# Altium schematic sheet BUTTONS.SchDoc: =DocumentName
size A4; CompanyName: "AS Manufacturing" LLC; Organization: "AS Manufacturing" LLC; Address1: 5 Sklyarenka St.; Address2: Kyiv 04073; Address3: Ukraine; Address4: https://ajax.systems/en/; SheetNumber: 5; SheetTotal: 5; Template_version: 1.0.1
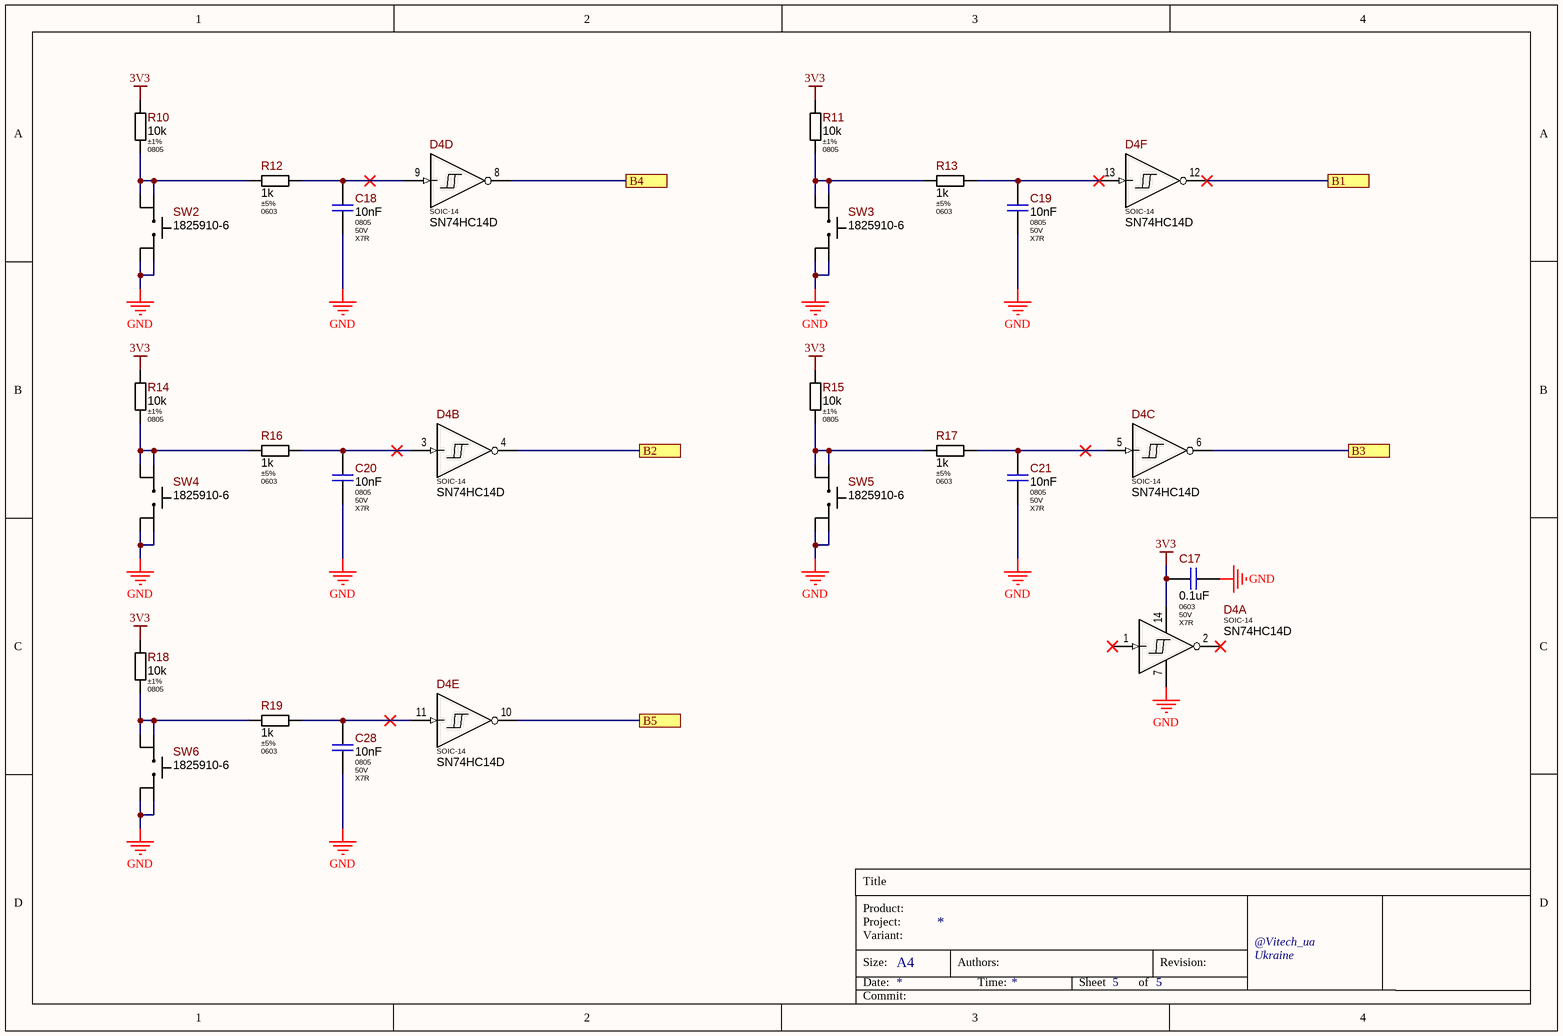
[diagram p0: BUTTONS.SchDoc]

## Parts
C17  Package: 0603  Voltage: 50V  Dielectric Type: X7R  [C_CERAMIC_0603_MED]  (hidden comment: 0.1uF)
C18  Package: 0805  Voltage: 50V  Dielectric Type: X7R  [CAP-0805(2012)X65T10]  (hidden comment: 10nF)
C19  Package: 0805  Voltage: 50V  Dielectric Type: X7R  [CAP-0805(2012)X65T10]  (hidden comment: 10nF)
C20  Package: 0805  Voltage: 50V  Dielectric Type: X7R  [CAP-0805(2012)X65T10]  (hidden comment: 10nF)
C21  Package: 0805  Voltage: 50V  Dielectric Type: X7R  [CAP-0805(2012)X65T10]  (hidden comment: 10nF)
C28  Package: 0805  Voltage: 50V  Dielectric Type: X7R  [CAP-0805(2012)X65T10]  (hidden comment: 10nF)
D4  SN74HC14D  [SOIC-14]  (parts A,B,C,D,E,F of 6)
R10  Tolerance: ±1%  Package: 0805  [R_ANY_CHIP_0805_MED]  (hidden comment: 10k)
R11  Tolerance: ±1%  Package: 0805  [R_ANY_CHIP_0805_MED]  (hidden comment: 10k)
R12  Tolerance: ±5%  Package: 0603  [R_ANY_CHIP_0603_MED]  (hidden comment: 1k)
R13  Tolerance: ±5%  Package: 0603  [R_ANY_CHIP_0603_MED]  (hidden comment: 1k)
R14  Tolerance: ±1%  Package: 0805  [R_ANY_CHIP_0805_MED]  (hidden comment: 10k)
R15  Tolerance: ±1%  Package: 0805  [R_ANY_CHIP_0805_MED]  (hidden comment: 10k)
R16  Tolerance: ±5%  Package: 0603  [R_ANY_CHIP_0603_MED]  (hidden comment: 1k)
R17  Tolerance: ±5%  Package: 0603  [R_ANY_CHIP_0603_MED]  (hidden comment: 1k)
R18  Tolerance: ±1%  Package: 0805  [R_ANY_CHIP_0805_MED]  (hidden comment: 10k)
R19  Tolerance: ±5%  Package: 0603  [R_ANY_CHIP_0603_MED]  (hidden comment: 1k)
SW2  FSM4JH  [1825910-6]  (value not drawn)
SW3  FSM4JH  [1825910-6]  (value not drawn)
SW4  FSM4JH  [1825910-6]  (value not drawn)
SW5  FSM4JH  [1825910-6]  (value not drawn)
SW6  FSM4JH  [1825910-6]  (value not drawn)

## Ports
B1, B2, B3, B4, B5

## Nets
3V3: C17.1 D4.14(VCC) R10.1 R11.1 R14.1 R15.1 R18.1
GND: C17.2 C18.2 C19.2 C20.2 C21.2 C28.2 D4.7(GND) SW2.3 SW2.4 SW3.3 SW3.4 SW4.3 SW4.4 SW5.3 SW5.4 SW6.3 SW6.4
B1: D4.12 ; port B1
B2: D4.4 ; port B2
B3: D4.6 ; port B3
B4: D4.8 ; port B4
B5: D4.10 ; port B5
NetC18_1: C18.1 D4.9 R12.2
NetC19_1: C19.1 D4.13 R13.2
NetC20_1: C20.1 D4.3 R16.2
NetC21_1: C21.1 D4.5 R17.2
NetC28_1: C28.1 D4.11 R19.2
NetR10_2: R10.2 R12.1 SW2.1 SW2.2
NetR11_2: R11.2 R13.1 SW3.1 SW3.2
NetR14_2: R14.2 R16.1 SW4.1 SW4.2
NetR15_2: R15.2 R17.1 SW5.1 SW5.2
NetR18_2: R18.2 R19.1 SW6.1 SW6.2

Not connected (* = marked no-connect by the designer): D4 1* 2*

## Notes on the sheet
- Title
- Product:
- Project:
- Size:
- Date:
- Variant:
- A4
- Authors:
- Time:
- Sheet
- of
- Revision:
- @Vitech_ua
- Commit:

## Library data of the parts
C17 = CL10B104KB8NNND: 100nF 50V X7R ±10% 0603 Ceramic Capacitor RoHS; Manufacturer: Samsung Electro-Mechanics; Ajax_1C_ID: 21313; Ajax_1C_PN: 100nF 50V X7R 10% 0603 CL10B104KB8NNND ceramic capacitor SMD; Ajax_1С_Status: Substitution; Standard Lead Time: 18 Weeks; Component Status: Released; Replacement: CL10B104KB8NNNC; GUID_1C: f1fd6399-ca68-11ea-ab63-0050569f2651; Value: 0.1uF; Part Number: CL10B104KB8NNND; Part Type: Ceramic / X7R / 0603; Component Type: SMD; Temperature Range: -55°C ~ 125°C; Tolerance: ±10%; ComponentLink1URL: https://media.digikey.com/pdf/Data%20Sheets/Samsung%20PDFs/CL_Series_MLCC_ds.pdf; Supplier 1: Digi-Key; Supplier Part Number 1: CL10B104KB8NNND-ND; Price: 0,0039378; ComponentLink1Description: Datasheet
C18-C21 C28 = CL21B103KBANNNC: 10nF 50V X7R ±10% 0805 Ceramic Capacitor RoHS; Manufacturer: Samsung Electro-Mechanics; Ajax_1C_PN: NONE; Ajax_1С_Status: RND Only; Standard Lead Time: 26 Weeks; Component Status: Released; Value: 10nF; Part Number: CL21B103KBANNNC; Part Type: Ceramic / X7R / 0805; Component Type: SMD; Temperature Range: -55°C ~ 125°C; Tolerance: ±10%; ComponentLink1URL: https://eu.mouser.com/datasheet/2/585/MLCC-1837944.pdf; Supplier 1: Mouser; Supplier Part Number 1: 187-CL21B103KBANNNC; Replacement: NONE; Price: NONE; ComponentLink1Description: Datasheet
D4 = SN74HC14D: Hex Inverters with Schmitt-Trigger Inputs, SOIC-14; Manufacturer: Texas Instruments; Ajax_1C_ID: 67389; Ajax_1C_PN: SN74HC14D Inverter IC 6 Channel Schmitt Trigger 14-SOIC TI; Ajax_1С_Status: RND Only; Standard Lead Time: 50 Weeks; Component Status: Released; Replacement: NONE; GUID_1C: 72d75cb0-dd3a-11ed-a36c-005056994834; Package: SOIC-14; Part Number: SN74HC14D; Part Type: Logic / Inverters; Component Type: SMD; Temperature Range: -40°C ~ 85°C; ComponentLink1URL: https://www.ti.com/lit/ds/symlink/sn54hc14-sp.pdf; Supplier 1: Mouser; Supplier Part Number 1: 595-SN74HC14D; Price: 0,19; ComponentLink1Description: Datasheet
R10 R11 R14 R15 R18 = RC0805FR-0710K2L: 10 kOhms ±1%, 1/8W 0805 Thick Film Resistor; Manufacturer: Yageo; Ajax_1C_ID: 13943; Ajax_1C_PN: 10.2k 1% 0805 Resistors SMD RoHS; Ajax_1С_Status: Mass Production; Power Rating: 0.125W; Voltage: 150V; Component Status: Released; Temperature Stability: ±100ppm/°C; Replacement: NONE; GUID_1C: 8bc9d0ce-c58a-11e8-ab47-0050569f2651; Value: 10k; Part Number: RC0805FR-0710K2L; Component Type: SMD; Part Type: Thick Film; Temperature Range: -55°C ~ 155°C; ComponentLink1URL: https://eu.mouser.com/datasheet/2/447/PYu_RC_Group_51_RoHS_L_10-1664068.pdf; Supplier 1: Digi-Key; Supplier Part Number 1: 311-10.2KCRTR-ND; Price: 0,0014; ComponentLink1Description: Datasheet
R12 R13 R16 R17 R19 = RC0603JR-071KL: 1 kOhms ±5%, 1/10W 0603 Thick Film Resistor; Manufacturer: Yageo; Ajax_1C_ID: 28124; Ajax_1C_PN: 1k 5% 0603 Resistors SMD RoHS; Ajax_1С_Status: Mass Production; Power Rating: 0.1W; Voltage: 75V; Component Status: Released; Temperature Stability: ±100ppm/°C; Replacement: NONE; GUID_1C: fbc5fd6b-8d66-11eb-ab70-0050569f2651; Value: 1k; Part Number: RC0603JR-071KL; Component Type: SMD; Part Type: Thick Film; Temperature Range: -55°C ~ 155°C; ComponentLink1URL: https://eu.mouser.com/datasheet/2/447/PYu_RC_Group_51_RoHS_L_11-1984063.pdf; Supplier 1: Digi-Key; Supplier Part Number 1: 311-1.0KGRTR-ND; Price: 0,00072; ComponentLink1Description: Datasheet
SW2-SW6 = 1825910-6: Tactile Switch, SPST-NO, Top Actuated, PTH; Manufacturer: TE Connectivity; Ajax_1C_PN: NONE; Ajax_1С_Status: RND Only; Component Status: On Review; Part Number: 1825910-6; Part Type: Switch / Tactile; Component Type: PTH; Temperature Range: -35°C ~ 85°C; ComponentLink1URL: https://www.te.com/commerce/DocumentDelivery/DDEController?Action=srchrtrv&DocNm=1825910&DocType=Customer+Drawing&DocLang=English; Supplier 1: Digi-Key; Supplier Part Number 1: 450-1650-ND; Replacement: NONE; Price: NONE; ComponentLink1Description: Datasheet